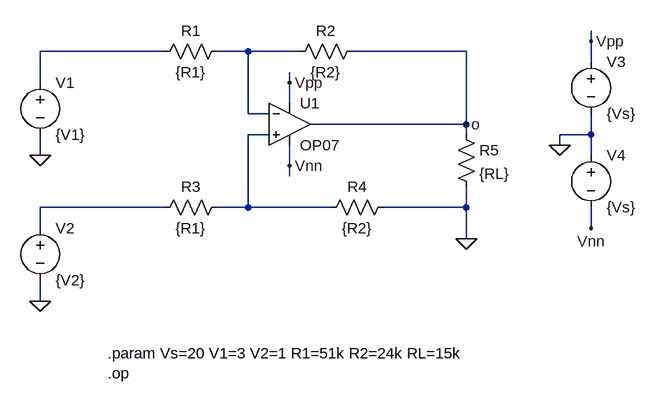
[diagram p0: schematic Q4.asc]
Q4.asc, the LTspice schematic file:
Version 4.1
SHEET 1 880 680
WIRE 768 16 768 0
WIRE 112 32 -80 32
WIRE 240 32 192 32
WIRE 320 32 240 32
WIRE 576 32 400 32
WIRE 768 48 768 16
WIRE -80 80 -80 32
WIRE 304 80 304 64
WIRE 304 112 304 80
WIRE 240 128 240 32
WIRE 272 128 240 128
WIRE 576 144 576 32
WIRE 576 144 336 144
WIRE 272 160 240 160
WIRE 576 160 576 144
WIRE 768 160 768 128
WIRE 768 160 720 160
WIRE 720 176 720 160
WIRE -80 192 -80 160
WIRE 768 192 768 160
WIRE 304 208 304 176
WIRE 304 224 304 208
WIRE 112 272 -80 272
WIRE 240 272 240 160
WIRE 240 272 192 272
WIRE 368 272 240 272
WIRE 576 272 576 240
WIRE 576 272 448 272
WIRE -80 304 -80 272
WIRE 768 304 768 272
WIRE 576 320 576 272
WIRE -80 416 -80 384
FLAG -80 192 0
FLAG -80 416 0
FLAG 304 80 Vpp
FLAG 304 208 Vnn
FLAG 576 320 0
FLAG 720 176 0
FLAG 768 16 Vpp
FLAG 768 304 Vnn
FLAG 576 144 o
SYMBOL voltage -80 64 R0
SYMATTR InstName V1
SYMATTR Value {V1}
SYMBOL voltage -80 288 R0
SYMATTR InstName V2
SYMATTR Value {V2}
SYMBOL res 208 16 R90
WINDOW 0 0 56 VBottom 2
WINDOW 3 32 56 VTop 2
SYMATTR InstName R1
SYMATTR Value {R1}
SYMBOL res 208 256 R90
WINDOW 0 0 56 VBottom 2
WINDOW 3 32 56 VTop 2
SYMATTR InstName R3
SYMATTR Value {R1}
SYMBOL OpAmps\\OP07 304 80 R0
SYMATTR InstName U1
SYMBOL res 416 16 R90
WINDOW 0 0 56 VBottom 2
WINDOW 3 32 56 VTop 2
SYMATTR InstName R2
SYMATTR Value {R2}
SYMBOL res 464 256 R90
WINDOW 0 0 56 VBottom 2
WINDOW 3 32 56 VTop 2
SYMATTR InstName R4
SYMATTR Value {R2}
SYMBOL res 560 144 R0
SYMATTR InstName R5
SYMATTR Value {RL}
SYMBOL voltage 768 32 R0
SYMATTR InstName V3
SYMATTR Value {Vs}
SYMBOL voltage 768 176 R0
SYMATTR InstName V4
SYMATTR Value {Vs}
TEXT 24 496 Left 2 !.param Vs=20 V1=3 V2=1 R1=51k R2=24k RL=15k\n.op

The netlist it stands for:
* Q4.asc
V1 N001 0 {V1}
V2 N004 0 {V2}
R1 N002 N001 {R1}
R3 N003 N004 {R1}
X§U1 N003 N002 Vpp Vnn o LT1001  ; OP07, pins In+ In- V+ V- OUT
R2 o N002 {R2}
R4 0 N003 {R2}
R5 o 0 {RL}
V3 Vpp 0 {Vs}
V4 0 Vnn {Vs}
.param Vs=20 V1=3 V2=1 R1=51k R2=24k RL=15k
.op
.lib LTC.lib
.backanno
.end